# Altium schematic sheet logic_sdram.SchDoc: mcHF Pro Transceiver UI board
size A3; Author: Krassi Atanassov; CompanyName: MØNKA; Engineer: For radio amateurs experimentation, non-commercial use only. Thank you!; Revision: 0.8.2; SheetTotal: 18
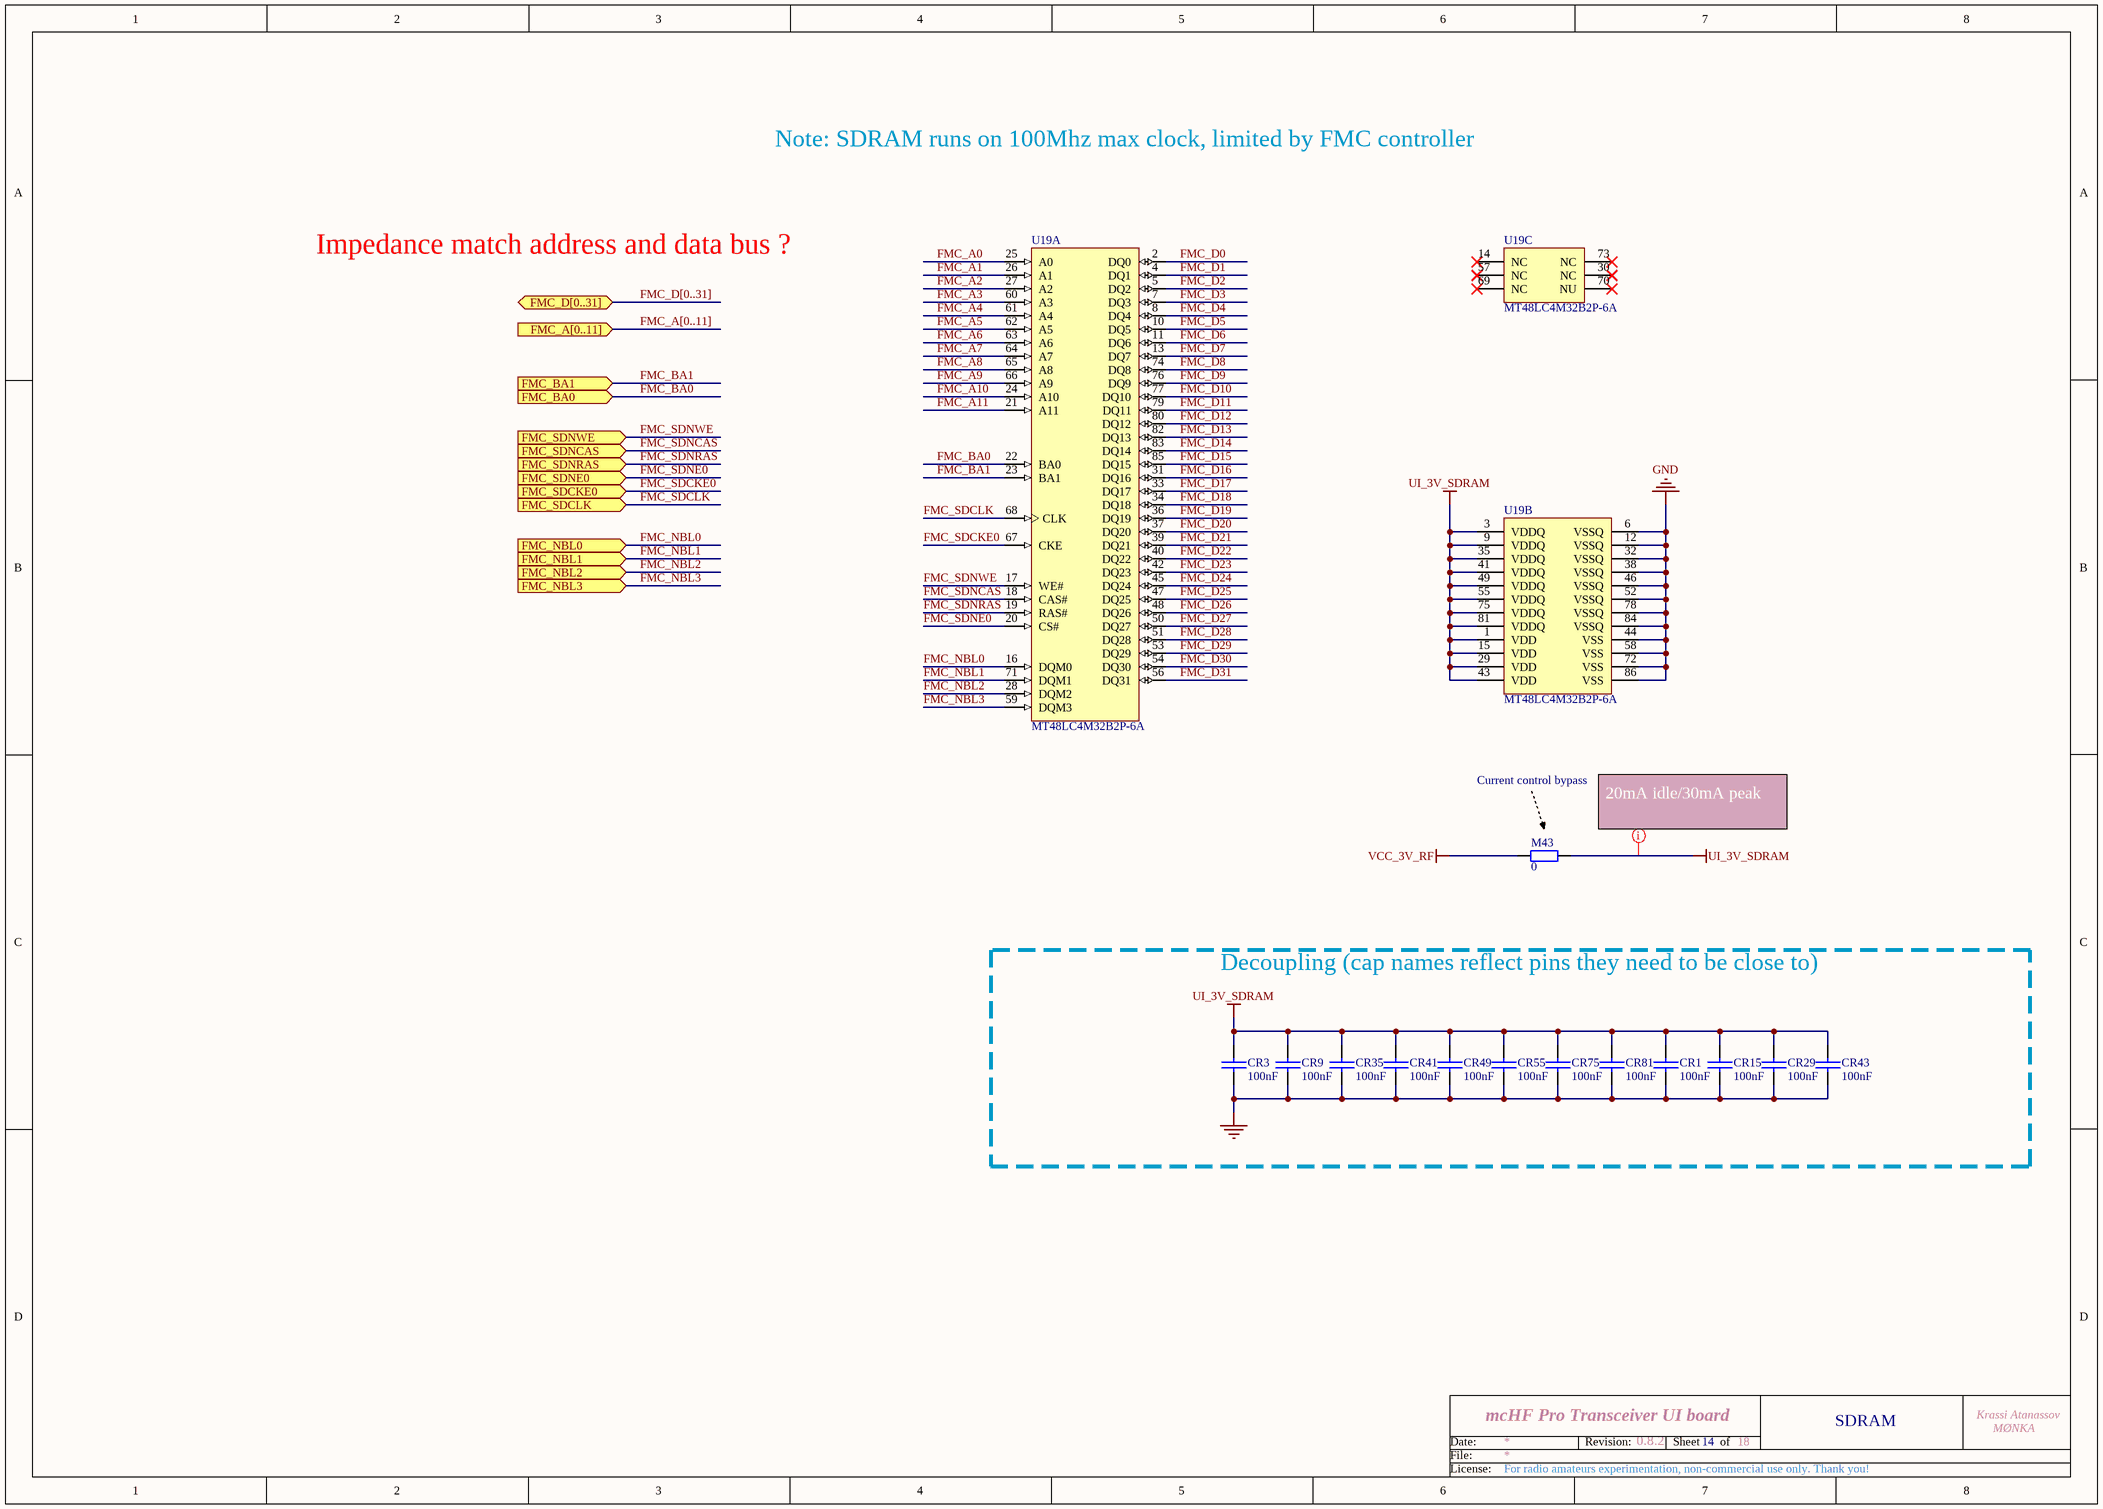
[diagram p0: logic_sdram.SchDoc]

## Parts
CR1  100nF  [0805]
CR3  100nF  [0805]
CR9  100nF  [0805]
CR15  100nF  [0805]
CR29  100nF  [0805]
CR35  100nF  [0805]
CR41  100nF  [0805]
CR43  100nF  [0805]
CR49  100nF  [0805]
CR55  100nF  [0805]
CR75  100nF  [0805]
CR81  100nF  [0805]
M43  0  [0805]
U19  MT48LC4M32B2P-6A  [MICT-TG-86_N]  (parts A,B,C of 3)

## Blocks framed on the sheet
Decoupling (cap names reflect pins they need to be close to): CR1 CR3 CR9 CR15 CR29 CR35 CR41 CR43 CR49 CR55 CR75 CR81

## Ports
FMC_A[0..11] (in), FMC_BA0 (in), FMC_BA1 (in), FMC_D[0..31] (bidir), FMC_NBL0 (in), FMC_NBL1 (in), FMC_NBL2 (in), FMC_NBL3 (in), FMC_SDCKE0 (in), FMC_SDCLK (in), FMC_SDNCAS (in), FMC_SDNE0 (in), FMC_SDNRAS (in), FMC_SDNWE (in)

## Nets
GND: CR1.2 CR3.2 CR9.2 CR15.2 CR29.2 CR35.2 CR41.2 CR43.2 CR49.2 CR55.2 CR75.2 CR81.2 U19.6(VSSQ) U19.12(VSSQ) U19.32(VSSQ) U19.38(VSSQ) U19.44(VSS) U19.46(VSSQ) U19.52(VSSQ) U19.58(VSS) U19.72(VSS) U19.78(VSSQ) U19.84(VSSQ) U19.86(VSS)
UI_3V_SDRAM: CR1.1 CR3.1 CR9.1 CR15.1 CR29.1 CR35.1 CR41.1 CR43.1 CR49.1 CR55.1 CR75.1 CR81.1 M43.2 U19.1(VDD) U19.3(VDDQ) U19.9(VDDQ) U19.15(VDD) U19.29(VDD) U19.35(VDDQ) U19.41(VDDQ) U19.43(VDD) U19.49(VDDQ) U19.55(VDDQ) U19.75(VDDQ) U19.81(VDDQ)
VCC_3V_RF: M43.1
FMC_A0: U19.25(A0)
FMC_A1: U19.26(A1)
FMC_A2: U19.27(A2)
FMC_A3: U19.60(A3)
FMC_A4: U19.61(A4)
FMC_A5: U19.62(A5)
FMC_A6: U19.63(A6)
FMC_A7: U19.64(A7)
FMC_A8: U19.65(A8)
FMC_A9: U19.66(A9)
FMC_A10: U19.24(A10)
FMC_A11: U19.21(A11)
FMC_BA0: U19.22(BA0) ; port FMC_BA0
FMC_BA1: U19.23(BA1) ; port FMC_BA1
FMC_D0: U19.2(DQ0)
FMC_D1: U19.4(DQ1)
FMC_D2: U19.5(DQ2)
FMC_D3: U19.7(DQ3)
FMC_D4: U19.8(DQ4)
FMC_D5: U19.10(DQ5)
FMC_D6: U19.11(DQ6)
FMC_D7: U19.13(DQ7)
FMC_D8: U19.74(DQ8)
FMC_D9: U19.76(DQ9)
FMC_D10: U19.77(DQ10)
FMC_D11: U19.79(DQ11)
FMC_D12: U19.80(DQ12)
FMC_D13: U19.82(DQ13)
FMC_D14: U19.83(DQ14)
FMC_D15: U19.85(DQ15)
FMC_D16: U19.31(DQ16)
FMC_D17: U19.33(DQ17)
FMC_D18: U19.34(DQ18)
FMC_D19: U19.36(DQ19)
FMC_D20: U19.37(DQ20)
FMC_D21: U19.39(DQ21)
FMC_D22: U19.40(DQ22)
FMC_D23: U19.42(DQ23)
FMC_D24: U19.45(DQ24)
FMC_D25: U19.47(DQ25)
FMC_D26: U19.48(DQ26)
FMC_D27: U19.50(DQ27)
FMC_D28: U19.51(DQ28)
FMC_D29: U19.53(DQ29)
FMC_D30: U19.54(DQ30)
FMC_D31: U19.56(DQ31)
FMC_NBL0: U19.16(DQM0) ; port FMC_NBL0
FMC_NBL1: U19.71(DQM1) ; port FMC_NBL1
FMC_NBL2: U19.28(DQM2) ; port FMC_NBL2
FMC_NBL3: U19.59(DQM3) ; port FMC_NBL3
FMC_SDCKE0: U19.67(CKE) ; port FMC_SDCKE0
FMC_SDCLK: U19.68(CLK) ; port FMC_SDCLK
FMC_SDNCAS: U19.18(CAS#) ; port FMC_SDNCAS
FMC_SDNE0: U19.20(CS#) ; port FMC_SDNE0
FMC_SDNRAS: U19.19(RAS#) ; port FMC_SDNRAS
FMC_SDNWE: U19.17(WE#) ; port FMC_SDNWE

Not connected (* = marked no-connect by the designer): U19 14(NC)* 30(NC)* 57(NC)* 69(NC)* 70(NU)* 73(NC)*

## Buses and harness runs
bus FMC_A[0..11] = port FMC_A[0..11]
bus FMC_D[0..31] = port FMC_D[0..31]

## Layout directives
rule Width Constraint [Pref Width = 12mil    Min Width = 12mil    Max Width = 12mil]: UI_3V_SDRAM

## Notes on the sheet
- Note: SDRAM runs on 100Mhz max clock, limited by FMC controller
- Impedance match address and data bus ?
- Current control bypass
- (near M43) 20mA idle/30mA peak
- 14
- SDRAM
- Date:
- File:
- Revision:
- Sheet
- of
- License:

## Library data of the parts
CR1 CR3 CR9 CR15 CR29 CR35 CR41 CR43 CR49 CR55 CR75 CR81 = CAP: Capacitor; Order: FN 282-1264; QT Order: QCC-00157; Price: 0.089
M43 = RES: Resistor; Order: FN 933-3681; QT Order: QCR-00268; Price: 0.009
U19 = MT48LC4M32B2P-6A: 128Mb PC133 SDR SDRAM, 4Mb x 32, 6ns, 3.3V, 0 to 70 degC, 86-Pin TSOP; Order: FN 225-3746; Price: 8.55